# Altium schematic sheet PowerSupplies.SchDoc: Power Supplies
size Letter; Organization: Midnight Sun Solar Rayce Car Team; Address1: University of Waterloo; Address2: 200 University Ave W; Address3: Waterloo, ON, Canada; Address4: N2L 3E9; SheetNumber: 2; SheetTotal: 4; Website: www.uwmidsun.com
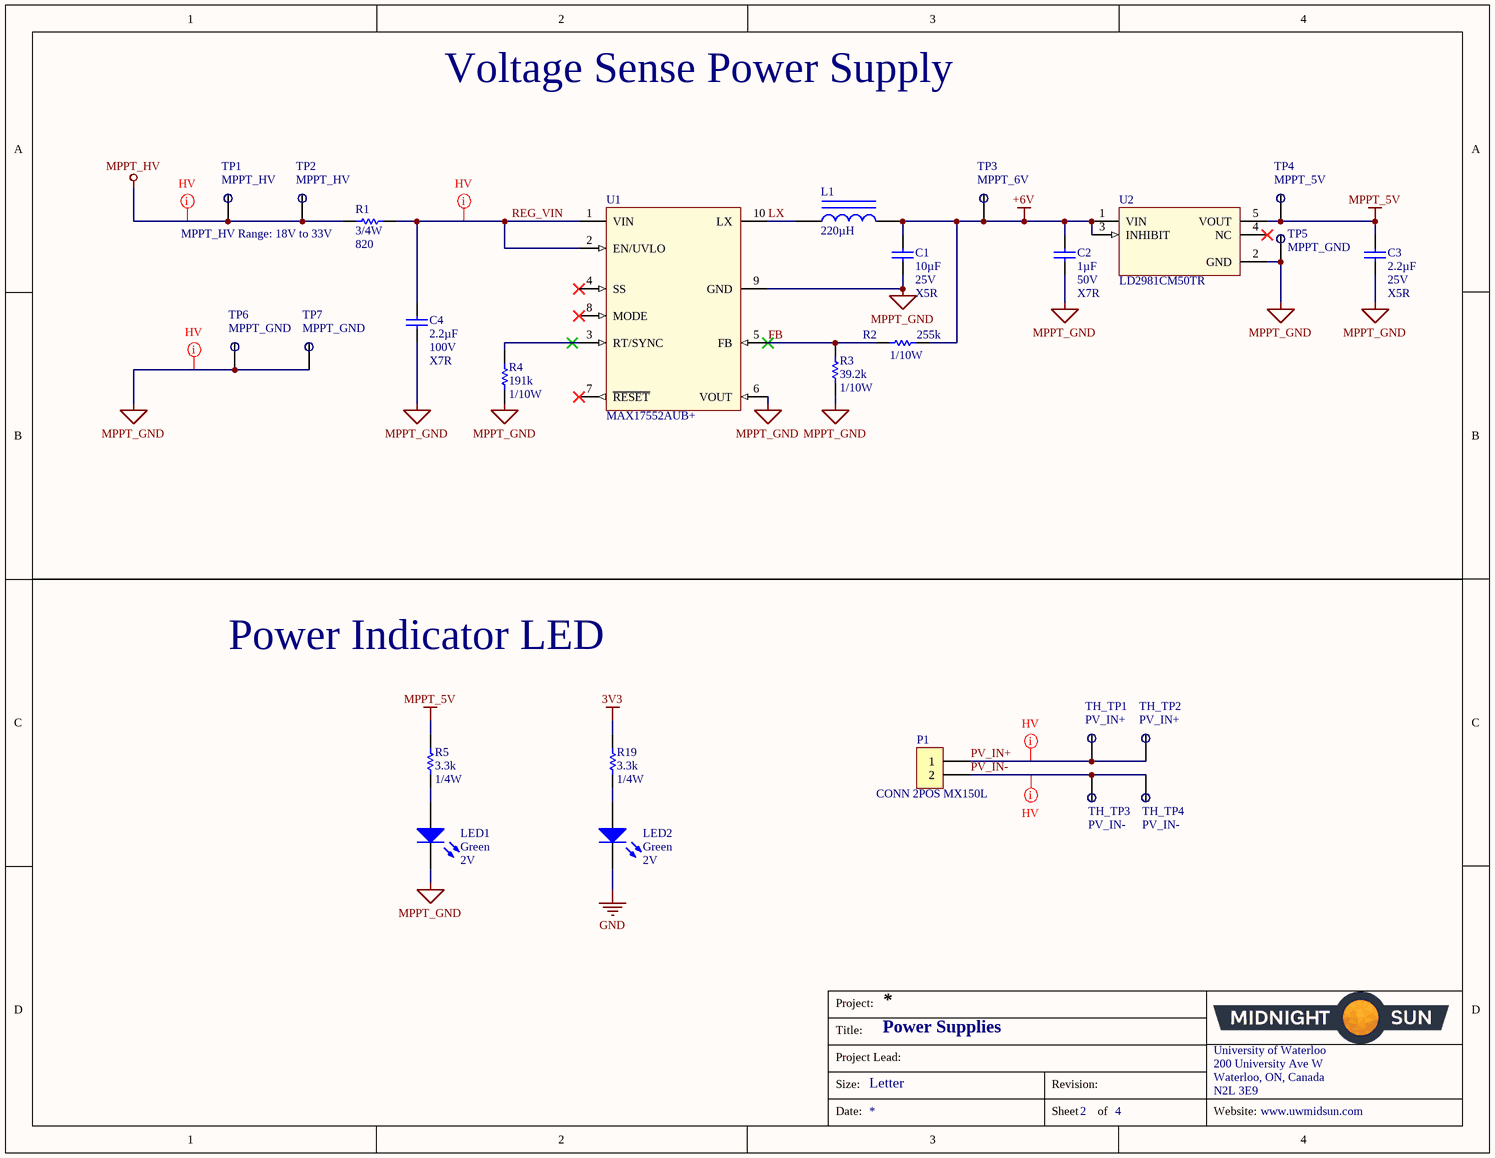
[diagram p0: PowerSupplies.SchDoc]

## Parts
C1  Capacitance: 10µF  Voltage: 25V  Temperature Coefficient: X5R  [CAP, 0603]  (hidden comment: CAP CER 10uF 25V 20% X5R 0603)
C2  Capacitance: 1µF  Voltage: 50V  Temperature Coefficient: X7R  [CAP, 0603]  (hidden comment: CAP CER 1UF 50V 10% X7R 0603)
C3  Capacitance: 2.2µF  Voltage: 25V  Temperature Coefficient: X5R  [CAP, 0603]  (hidden comment: CAP CER 2.2UF 25V 10% X5R 0603)
C4  Capacitance: 2.2µF  Voltage: 100V  Temperature Coefficient: X7R  [CAP, 1206]  (hidden comment: CAP CER 2.2UF 100V ±20% X7R 1206)
L1  Inductance: 220µH  [INDP6060X23N]  (hidden comment: IND 220uH 0.59A 20%)
LED1  Color: Green  Voltage - Forward (Vf) (Typ): 2V  [LED_0603]  (hidden comment: LED GREEN CLEAR 2V 0603)
LED2  Color: Green  Voltage - Forward (Vf) (Typ): 2V  [LED_0603]  (hidden comment: LED GREEN CLEAR 2V 0603)
P1  CONN 2POS MX150L  [CONN, 2POS MX150L]
R1  Power: 3/4W  Resistance: 820  [RES 2010]  (hidden comment: RES 820 OHM 5% 3/4W 2010)
R2  Resistance (Ohms): 255k  Power (Watts): 1/10W  [RES, 0603]  (hidden comment: RES 255K OHM 1% 1/10W 0603)
R3  Resistance: 39.2k  Power: 1/10W  [RES, 0603]  (hidden comment: RES 39.2K OHM 1% 1/10W 0603)
R4  Resistance: 191k  Power: 1/10W  [RES, 0603]  (hidden comment: RES 191K OHM 1% 1/10W 0603)
R5  Resistance: 3.3k  Power: 1/4W  [RES, 0603]  (hidden comment: RES 3.3K OHM 1% 1/4W 0603)
R19  Resistance: 3.3k  Power: 1/4W  [RES, 0603]  (hidden comment: RES 3.3K OHM 1% 1/4W 0603)
TH_TP1  PV_IN+  [Thru Test Point]
TH_TP2  PV_IN+  [Thru Test Point]
TH_TP3  PV_IN-  [Thru Test Point]
TH_TP4  PV_IN-  [Thru Test Point]
TP1  MPPT_HV  [Thru Test Point]
TP2  MPPT_HV  [Thru Test Point]
TP3  MPPT_6V  [Thru Test Point]
TP4  MPPT_5V  [Thru Test Point]
TP5  MPPT_GND  [Thru Test Point]
TP6  MPPT_GND  [Thru Test Point]
TP7  MPPT_GND  [Thru Test Point]
U1  Manufacturer Part Number 1: MAX17552AUB+  [TSSOP50P490X110-10N]  (hidden comment: IC REG BUCK ADJ 0.1A 10UMAX)
U2  Manufacturer Part Number 1: LD2981CM50TR  [SOT95P280X145-5N]  (hidden comment: IC REG LDO 5V 0.1A SOT23-5)

## Nets
3V3: R19.1
+6V: C1.1 C2.1 L1.2 R2.2 TP3.TH_TP U2.1(VIN) U2.3(INHIBIT)
GND: LED2.2(K)
MPPT_5V: C3.1 R5.1 TP4.TH_TP U2.5(VOUT)
MPPT_GND: C1.2 C2.2 C3.2 C4.2 LED1.2(K) R3.2 R4.2 TP5.TH_TP TP6.TH_TP TP7.TH_TP U1.6(VOUT) U1.9(GND) U2.2(GND)
MPPT_HV: R1.1 TP1.TH_TP TP2.TH_TP
FB: R2.1 R3.1 U1.5(FB)
LX: L1.1 U1.10(LX)
PV_IN+: P1.1 TH_TP1.TH_TP TH_TP2.TH_TP
PV_IN-: P1.2 TH_TP3.TH_TP TH_TP4.TH_TP
REG_VIN: C4.1 R1.2 U1.1(VIN) U1.2(EN/UVLO)
NetLED1_1: LED1.1(A) R5.2
NetLED2_1: LED2.1(A) R19.2
NetR4_1: R4.1 U1.3(RT/SYNC)

Not connected (* = marked no-connect by the designer): U1 4(SS)* 7(~{RESET})* 8(MODE)*; U2 4(NC)*

## Layout directives
net class HV: MPPT_GND, MPPT_HV, PV_IN+, PV_IN-, REG_VIN

## Notes on the sheet
- Voltage Sense Power Supply
- MPPT_HV Range: 18V to 33V
- Power Indicator LED
- Project:
- Title:
- Size:
- Project Lead:
- Letter
- Revision:
- University of Waterloo
- 200 University Ave W
- Waterloo, ON, Canada
- N2L 3E9
- Date:
- Sheet
- of
- Website:

## Library data of the parts
C1 = CAP CER 10uF 25V 20% X5R 0603: 10µF ±20% 25V Ceramic Capacitor X5R 0603 (1608 Metric); Manufacturer 1: Murata Electronics North America; Manufacturer Part Number 1: GRM188R61E106MA73D; Supplier 1: Digi-Key; Supplier Part Number 1: 490-7202-1-ND; Packaging: Cut Tape (CT); Part Status: Active; Operating Temperature: -55°C ~ 85°C; Ratings: -; Mounting Type: Surface Mount, MLCC; Package / Case: 0603 (1608 Metric); Size / Dimension: 0.063" L x 0.031" W (1.60mm x 0.80mm); Height - Seated (Max): -; Thickness (Max): 0.031" (0.80mm); Lead Spacing: -; Lead Style: -; ComponentLink1URL: http://www.murata.com/~/media/webrenewal/support/library/catalog/products/capacitor/mlcc/c02e.ashx; ComponentLink1Description: http://www.murata.com/~/media/webrenewal/support/library/catalog/products/capacitor/mlcc/c02e.ashx; Tolerance: ±20%
C2 = CAP CER 1UF 50V 10% X7R 0603: 1µF ±10% 50V Ceramic Capacitor X7R 0603 (1608 Metric); Manufacturer 1: Taiyo Yuden; Manufacturer Part Number 1: UMK107AB7105KA-T; Supplier 1: Digi-Key; Supplier Part Number 1: 587-3247-1-ND; Packaging: Cut Tape (CT); Part Status: Active; Operating Temperature: -55°C ~ 125°C; Ratings: -; Mounting Type: Surface Mount, MLCC; Package / Case: 0603 (1608 Metric); Size / Dimension: 0.063" L x 0.031" W (1.60mm x 0.80mm); Height - Seated (Max): -; Thickness (Max): 0.037" (0.95mm); Lead Spacing: -; Lead Style: -; ComponentLink1URL: http://www.yuden.co.jp/productdata/catalog/en/mlcc_all_e.pdf; ComponentLink1Description: http://www.yuden.co.jp/productdata/catalog/en/mlcc_all_e.pdf; Tolerance: ±10%
C3 = CAP CER 2.2UF 25V 10% X5R 0603: 2.2µF ±10% 25V Ceramic Capacitor X5R 0603 (1608 Metric); Manufacturer 1: Murata Electronics North America; Manufacturer Part Number 1: GRM188R61E225KA12D; Supplier 1: Digi-Key; Supplier Part Number 1: 490-10731-1-ND; Packaging: Cut Tape (CT); Part Status: Active; Operating Temperature: -55°C ~ 85°C; Ratings: -; Mounting Type: Surface Mount, MLCC; Package / Case: 0603 (1608 Metric); Size / Dimension: 0.063" L x 0.031" W (1.60mm x 0.80mm); Height - Seated (Max): -; Thickness (Max): 0.035" (0.90mm); Lead Spacing: -; Lead Style: -; ComponentLink1URL: http://www.murata.com/~/media/webrenewal/support/library/catalog/products/capacitor/mlcc/c02e.ashx; ComponentLink1Description: http://www.murata.com/~/media/webrenewal/support/library/catalog/products/capacitor/mlcc/c02e.ashx; Tolerance: ±10%
C4 = CAP CER 2.2UF 100V ±20% X7R 1206: 2.2µF ±20% 100V Ceramic Capacitor X7R 1206 (3216 Metric); Manufacturer 1: Murata Electronics North America; Manufacturer Part Number 1: GRM31CR72A225MA73L; Supplier 1: Digi-Key; Supplier Part Number 1: 490-12773-1-ND; Packaging: Cut Tape (CT); Part Status: Active; Operating Temperature: -55°C ~ 125°C; Ratings: -; Mounting Type: Surface Mount, MLCC; Package / Case: 1206 (3216 Metric); Size / Dimension: 0.126" L x 0.063" W (3.20mm x 1.60mm); Height - Seated (Max): -; Thickness (Max): 0.071" (1.80mm); Lead Spacing: -; Lead Style: -; ComponentLink1URL: http://www.murata.com/~/media/webrenewal/support/library/catalog/products/capacitor/mlcc/c02e.ashx; ComponentLink1Description: http://www.murata.com/~/media/webrenewal/support/library/catalog/products/capacitor/mlcc/c02e.ashx; Tolerance: ±20%
L1 = IND 220uH 0.59A 20%: 220µH Shielded Inductor 590mA 834 mOhm Nonstandard; Manufacturer 1: Laird-Signal Integrity Products; Manufacturer Part Number 1: TYS6045221M-10; Current - Saturation: 700mA; Frequency - Self Resonant: 3.5MHz; Supplier 1: Digi-Key; Supplier Part Number 1: 240-2742-1-ND; Packaging: Cut Tape (CT); Part Status: Active; Type: -; Material - Core: -; Current Rating: 590mA; Shielding: Shielded; DC Resistance (DCR): 834 mOhm; Q @ Freq: -; Ratings: AEC-Q200; Operating Temperature: -40°C ~ 125°C; Mounting Type: Surface Mount; Package / Case: Nonstandard; Supplier Device Package: -; Size / Dimension: 0.236" L x 0.236" W (6.00mm x 6.00mm); Height - Seated (Max): 0.185" (4.70mm); ComponentLink1URL: http://assets.lairdtech.com/home/brandworld/files/TYS6045221M-10.pdf; ComponentLink1Description: http://assets.lairdtech.com/home/brandworld/files/TYS6045221M-10.pdf; Tolerance: ±20%
LED1 LED2 = LED GREEN CLEAR 2V 0603: Green 572nm LED Indication - Discrete 2V 0603 (1608 Metric); Manufacturer: Wurth Electronics Inc.; Manufacturer Part Number: 150060VS75000; Lens Color: Colorless; Millicandela Rating: 40mcd; Lens Style/Size: Rectangle with Flat Top, 1.10mm x 0.70mm; Current - Test: 20mA; Viewing Angle: 140°; Wavelength - Dominant: 570nm; Supplier 1: Digi-Key; RoHS: RoHS Compliant; Category: Optoelectronics; Stock 1: 9408; Pricing 1: 1=0.21, 100=0.1617, 500=0.13964 (CAD); Packaging: Cut Tape (CT); Part Status: Active; Lens Transparency: Clear; Mounting Type: Surface Mount; Wavelength - Peak: 572nm; Features: -; Package / Case: 0603 (1608 Metric); Supplier Device Package: 0603; Size / Dimension: 1.60mm L x 0.80mm W; Height (Max): 0.80mm; ComponentLink1URL: http://katalog.we-online.de/led/datasheet/150060VS75000.pdf; ComponentLink1Description: http://katalog.we-online.de/led/datasheet/150060VS75000.pdf; Supplier Part Number 1: 732-4980-1-ND
P1 = CONN 2POS MX150L: Connector Header Panel Mount, Through Hole, Right Angle 2 position 0.230" (5.84mm); Manufacturer: Molex, LLC; Manufacturer Part Number: 0194270109; Number of Positions: 2; Number of Positions Loaded: All; Style: Board to Cable/Wire; Shrouding: Shrouded - 4 Wall; Contact Length - Post: 0.134" (3.40mm); Material Flammability Rating: UL94 V-0; Supplier 1: Digi-Key; RoHS: RoHS Compliant; Category: Connectors, Interconnects; Stock 1: 0; Pricing 1: 1040=3.59614 (CAD); Packaging: Tray; Part Status: Active; Connector Type: Header; Contact Type: Male Pin; Pitch - Mating: 0.230" (5.84mm); Number of Rows: 1; Row Spacing - Mating: -; Mounting Type: Panel Mount, Through Hole, Right Angle; Termination: Solder; Fastening Type: Locking Ramp; Contact Length - Mating: -; Overall Contact Length: -; Insulation Height: 1.147" (29.13mm); Contact Shape: Square; Contact Finish - Mating: Gold; Contact Finish Thickness - Mating: 30.0µin (0.76µm); Contact Finish - Post: Tin; Contact Material: Copper Alloy; Insulation Material: Polybutylene Terephthalate (PBT), Glass Filled; Features: Board Guide; Operating Temperature: -; Ingress Protection: -; Insulation Color: Black; Current Rating: -; Voltage Rating: -; Mated Stacking Heights: -; Contact Finish Thickness - Post: 100.0µin (2.54µm); Applications: Automotive, General Purpose, Industrial; ComponentLink1URL: https://www.molex.com/pdm_docs/sd/194270109_sd.pdf; ComponentLink1Description: https://www.molex.com/pdm_docs/sd/194270109_sd.pdf; Supplier Part Number 1: 0194270109-ND
R1 = RES 820 OHM 5% 3/4W 2010: 820 Ohms ±5% 0.75W, 3/4W Chip Resistor 2010 (5025 Metric) Automotive AEC-Q200 Thick Film; Manufacturer: Stackpole Electronics Inc.; Manufacturer Part Number: RMCF2010JT820R; Temperature Coefficient: ±200ppm/°C; Supplier 1: Digi-Key; RoHS: RoHS Compliant; Category: Resistors; Stock 1: 9416; Pricing 1: 1=0.35, 10=0.291, 100=0.1135, 1000=0.04752 (CAD); Packaging: Cut Tape (CT); Part Status: Active; Tolerance: ±5%; Power (Watts): 0.75W, 3/4W; Composition: Thick Film; Features: Automotive AEC-Q200; Operating Temperature: -55°C ~ 155°C; Package / Case: 2010 (5025 Metric); Supplier Device Package: 2010; Size / Dimension: 0.197" L x 0.098" W (5.00mm x 2.50mm); Height - Seated (Max): 0.028" (0.70mm); Failure Rate: -; ComponentLink1URL: https://www.seielect.com/Catalog/SEI-RMCF_RMCP.pdf; ComponentLink1Description: https://www.seielect.com/Catalog/SEI-RMCF_RMCP.pdf; Supplier Part Number 1: RMCF2010JT820RCT-ND
R2 = RES 255K OHM 1% 1/10W 0603: 255k Ohm ±1% 0.1W, 1/10W Chip Resistor 0603 (1608 Metric) Moisture Resistant Thick Film; Manufacturer 1: Yageo; Manufacturer Part Number 1: RC0603FR-07255KL; Description 1: RES SMD 255K OHM 1% 1/10W 0603; Temperature Coefficient: ±100ppm/°C; Supplier 1: Digi-Key; Supplier Part Number 1: 311-255KHRCT-ND; RoHS: RoHS Compliant; Category: Resistors; Stock 1: 106564; Pricing 1: 1=0.16, 10=0.022, 100=0.0089, 1000=0.00402, 2500=0.00349 (CAD); Packaging: Cut Tape (CT); Part Status: Active; Composition: Thick Film; Features: Moisture Resistant; Operating Temperature: -55°C ~ 155°C; Package / Case: 0603 (1608 Metric); Supplier Device Package: 0603; Size / Dimension: 0.063" L x 0.031" W (1.60mm x 0.80mm); Height - Seated (Max): 0.022" (0.55mm); Failure Rate: -; ComponentLink1URL: http://www.yageo.com/documents/recent/PYu-RC_Group_51_RoHS_L_7.pdf; ComponentLink1Description: http://www.yageo.com/documents/recent/PYu-RC_Group_51_RoHS_L_7.pdf; Tolerance: ±1%
R3 = RES 39.2K OHM 1% 1/10W 0603: 39.2k Ohm ±1% 0.1W, 1/10W Chip Resistor 0603 (1608 Metric) Moisture Resistant Thick Film; Manufacturer 1: Yageo; Manufacturer Part Number 1: RC0603FR-0739K2L; Temperature Coefficient: ±100ppm/°C; Supplier 1: Digi-Key; Supplier Part Number 1: 311-39.2KHRCT-ND; Packaging: Cut Tape (CT); Part Status: Active; Composition: Thick Film; Operating Temperature: -55°C ~ 155°C; Package / Case: 0603 (1608 Metric); Supplier Device Package: 0603; Size / Dimension: 0.063" L x 0.031" W (1.60mm x 0.80mm); Height - Seated (Max): 0.022" (0.55mm); Failure Rate: -; ComponentLink1URL: http://www.yageo.com/documents/recent/PYu-RC_Group_51_RoHS_L_7.pdf; ComponentLink1Description: http://www.yageo.com/documents/recent/PYu-RC_Group_51_RoHS_L_7.pdf; Tolerance: ±1%
R4 = RES 191K OHM 1% 1/10W 0603: 191k Ohm ±1% 0.1W, 1/10W Chip Resistor 0603 (1608 Metric) Moisture Resistant Thick Film; Manufacturer 1: Yageo; Manufacturer Part Number 1: RC0603FR-07191KL; Temperature Coefficient: ±100ppm/°C; Supplier 1: Digi-Key; Supplier Part Number 1: 311-191KHRCT-ND; Packaging: Cut Tape (CT); Part Status: Active; Composition: Thick Film; Operating Temperature: -55°C ~ 155°C; Package / Case: 0603 (1608 Metric); Supplier Device Package: 0603; Size / Dimension: 0.063" L x 0.031" W (1.60mm x 0.80mm); Height - Seated (Max): 0.022" (0.55mm); Failure Rate: -; ComponentLink1URL: http://www.yageo.com/documents/recent/PYu-RC_Group_51_RoHS_L_7.pdf; ComponentLink1Description: http://www.yageo.com/documents/recent/PYu-RC_Group_51_RoHS_L_7.pdf; Tolerance: ±1%
R5 R19 = RES 3.3K OHM 1% 1/4W 0603: 3.3k Ohm ±1% 0.25W, 1/4W Chip Resistor 0603 (1608 Metric) Automotive AEC-Q200, Pulse Withstanding Thick Film; Manufacturer 1: Panasonic Electronic Components; Manufacturer Part Number 1: ERJ-PA3F3301V; Temperature Coefficient: ±100ppm/°C; Supplier 1: Digi-Key; Supplier Part Number 1: P3.3KBYCT-ND; Packaging: Cut Tape (CT); Part Status: Active; Composition: Thick Film; Operating Temperature: -55°C ~ 155°C; Package / Case: 0603 (1608 Metric); Supplier Device Package: 0603; Size / Dimension: 0.063" L x 0.031" W (1.60mm x 0.80mm); Height - Seated (Max): 0.022" (0.55mm); Failure Rate: -; ComponentLink1URL: https://industrial.panasonic.com/cdbs/www-data/pdf/RDO0000/AOA0000C291.pdf; ComponentLink1Description: https://industrial.panasonic.com/cdbs/www-data/pdf/RDO0000/AOA0000C291.pdf; Tolerance: ±1%
TH_TP1-TH_TP4 TP1-TP7 = Thru Test Point
U1 = IC REG BUCK ADJ 0.1A 10UMAX: Buck Switching Regulator IC Positive Adjustable 0.8V 1 Output 100mA 10-TFSOP, 10-MSOP (0.118", 3.00mm Width); Manufacturer 1: Maxim Integrated; Function: Step-Down; Number of Outputs: 1; Voltage - Input (Min): 4V; Voltage - Input (Max): 60V; Voltage - Output (Max): 54V; Frequency - Switching: 100kHz ~ 2.2MHz; Synchronous Rectifier: Yes; Supplier 1: Digi-Key; Supplier Part Number 1: MAX17552AUB+-ND; Packaging: Tube; Part Status: Active; Output Configuration: Positive; Topology: Buck; Output Type: Adjustable; Voltage - Output (Min/Fixed): 0.8V; Current - Output: 100mA; Operating Temperature: -40°C ~ 125°C (TJ); Mounting Type: Surface Mount; Package / Case: 10-TFSOP, 10-MSOP (0.118", 3.00mm Width); Supplier Device Package: 10-uMAX; ComponentLink1URL: http://datasheets.maximintegrated.com/en/ds/MAX17552.pdf; ComponentLink1Description: http://datasheets.maximintegrated.com/en/ds/MAX17552.pdf
U2 = IC REG LDO 5V 0.1A SOT23-5: Linear Voltage Regulator IC Positive Fixed Output 5V 100mA SOT-23-5; Manufacturer 1: STMicroelectronics; Voltage - Dropout (Typical): 0.18V @ 100mA; Voltage - Input: Up to 16V; Supplier 1: Digi-Key; Supplier Part Number 1: 497-7787-1-ND; Packaging: Cut Tape (CT); Part Status: Active; Regulator Topology: Positive Fixed; Voltage - Output: 5V; Current - Output: 100mA; Current - Limit (Min): -; Operating Temperature: -40°C ~ 125°C; Mounting Type: Surface Mount; Package / Case: SC-74A, SOT-753; Supplier Device Package: SOT-23-5; ComponentLink1URL: http://www.st.com/content/ccc/resource/technical/document/datasheet/group1/b7/b5/a1/83/9c/bd/4a/90/CD00001635/files/CD00001635.pdf/jcr:content/translations/en.CD00001635.pdf; ComponentLink1Description: http://www.st.com/content/ccc/resource/technical/document/datasheet/group1/b7/b5/a1/83/9c/bd/4a/90/CD00001635/files/CD00001635.pdf/jcr:content/translations/en.CD00001635.pdf